# Altium schematic sheet FPGA_MICS_SUP.SchDoc: FMC DAC 1.5GS 4CH
size 420 x 297 mm; Author: G.Kasprowicz; CompanyName: WUT ISE; DrawnBy: G.Kasprowicz; Organization: WUT ISE; Address1: PW ISE; Address2: Nowowiejska 15/19 00-665 Warsaw; Address3: gkasprow@gmail.com; Revision: 1; SheetNumber: 20; SheetTotal: 21; ModifiedBy: -; CheckedDate: -; Title2: FMC; DivGrp: WUT ISE; Designer: G.Kasprowicz; ModifiedDate: -; ProjectName: Sensor Box
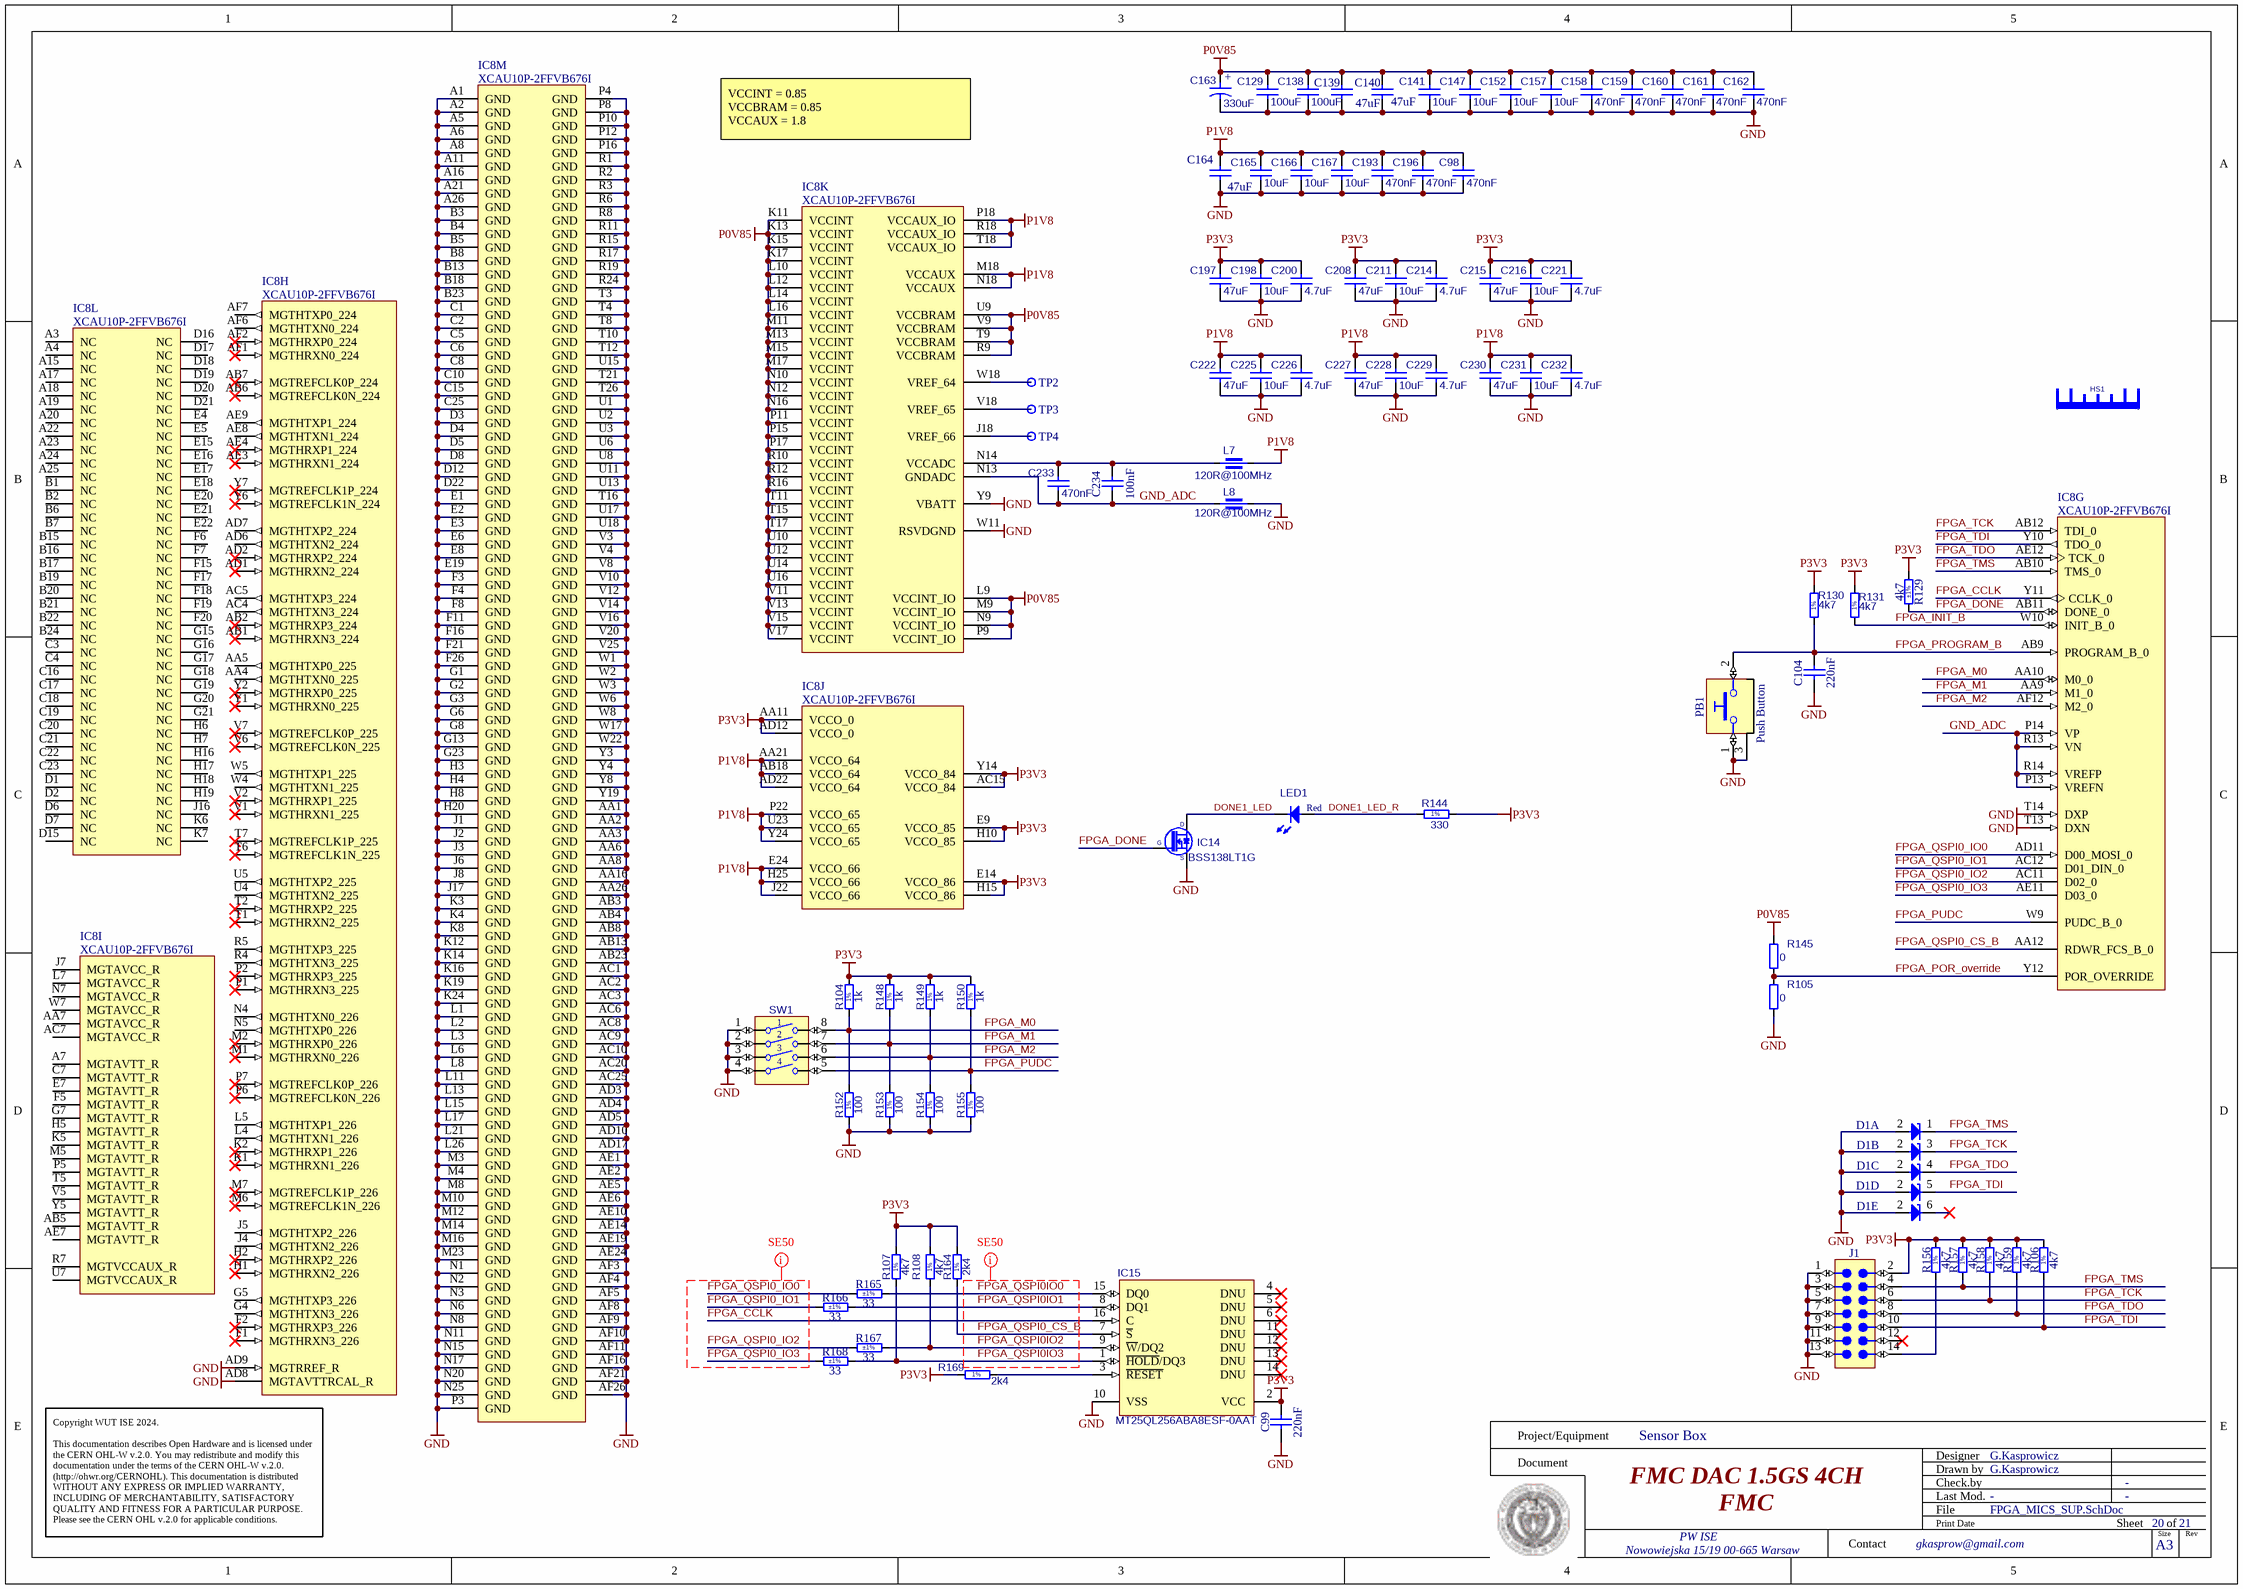
[diagram p0: FPGA_MICS_SUP.SchDoc]

## Parts
C98  470nF  [CAPC0603X33N]
C99  220nF  [CAPC1005X55N]
C104  220nF  [CAPC1005X55N]
C129  100uF  [CAPC2013X145N]
C138  100uF  [CAPC2013X145N]
C139  47uF  [CAPC1608X100N]
C140  47uF  [CAPC1608X100N]
C141  10uF  [CAPC1005X70N]
C147  10uF  [CAPC1005X70N]
C152  10uF  [CAPC1005X70N]
C157  10uF  [CAPC1005X70N]
C158  470nF  [CAPC0603X33N]
C159  470nF  [CAPC0603X33N]
C160  470nF  [CAPC0603X33N]
C161  470nF  [CAPC0603X33N]
C162  470nF  [CAPC0603X33N]
C163  330uF  [CAPMP3528X210N]
C164  47uF  [CAPC1608X100N]
C165  10uF  [CAPC1005X70N]
C166  10uF  [CAPC1005X70N]
C167  10uF  [CAPC1005X70N]
C193  470nF  [CAPC0603X33N]
C196  470nF  [CAPC0603X33N]
C197  47uF  [CAPC1608X100N]
C198  10uF  [CAPC1005X70N]
C200  4.7uF  [CAPC1005X61N]
C208  47uF  [CAPC1608X100N]
C211  10uF  [CAPC1005X70N]
C214  4.7uF  [CAPC1005X61N]
C215  47uF  [CAPC1608X100N]
C216  10uF  [CAPC1005X70N]
C221  4.7uF  [CAPC1005X61N]
C222  47uF  [CAPC1608X100N]
C225  10uF  [CAPC1005X70N]
C226  4.7uF  [CAPC1005X61N]
C227  47uF  [CAPC1608X100N]
C228  10uF  [CAPC1005X70N]
C229  4.7uF  [CAPC1005X61N]
C230  47uF  [CAPC1608X100N]
C231  10uF  [CAPC1005X70N]
C232  4.7uF  [CAPC1005X61N]
C233  470nF  [CAPC0603X33N]
C234  100nF  [CAPC1005X55N]
D1  PESD3V3L5UY  [SOT65P210X110-6N]  (value not drawn)  (parts A,B,C,D,E of 5)
HS1  Heat Sink 2 Pads  [HSINK_WAKEFIELD_960-29-18-D-AB-0]  (value not drawn)
IC8  XCAU10P-2FFVB676I  [BGA676C100P26X26_2700X2700X350]  (parts G,H,I,J,K,L,M of 13)
IC14  BSS138LT1G  [SOT95P240X110-3N]
IC15  MT25QL256ABA8ESF-0AAT  [SOIC127P1030X265-16N]
J1  (no value)  [MOLEX_87832-1420]
L7  120R@100MHz  [INDC1608X95N]
L8  120R@100MHz  [INDC1608X95N]
LED1  Red  [LED_KINGBRIGHT_KPH-1608SURCK]
PB1  Push Button  [PB_OMRON_B3U-1100P]
R104  1k  [RESC1005X40N]
R105  0  [RESC1005X40N]
R106  4k7  [RESC1005X40N]
R107  4k7  [RESC1005X40N]
R108  4k7  [RESC1005X40N]
R129  4k7  Tolerance: ±1%  [RESC1005X40N]
R130  4k7  [RESC1005X40N]
R131  4k7  [RESC1005X40N]
R144  330  [RESC1005X40N]
R145  0  [RESC1005X40N]
R148  1k  [RESC1005X40N]
R149  1k  [RESC1005X40N]
R150  1k  [RESC1005X40N]
R152  100  [RESC1005X40N]
R153  100  [RESC1005X40N]
R154  100  [RESC1005X40N]
R155  100  [RESC1005X40N]
R156  4k7  [RESC1005X40N]
R157  4k7  [RESC1005X40N]
R158  4k7  [RESC1005X40N]
R159  4k7  [RESC1005X40N]
R164  2k4  [RESC1005X40N]
R165  33  Tolerance: ±1%  [RESC1005X40N]
R166  33  Tolerance: ±1%  [RESC1005X40N]
R167  33  Tolerance: ±1%  [RESC1005X40N]
R168  33  Tolerance: ±1%  [RESC1005X40N]
R169  2k4  [RESC1005X40N]
SW1  Switch  [SW_TYCO_1571983-4]  (value not drawn)
TP2  Test Point  [TPS127]  (value not drawn)
TP3  Test Point  [TPS127]  (value not drawn)
TP4  Test Point  [TPS127]  (value not drawn)

## Nets
GND: C98.1 C99.1 C104.1 C129.1 C138.1 C139.1 C140.1 C141.1 C147.1 C152.1 C157.1 C158.1 C159.1 C160.1 C161.1 C162.1 C163.2 C164.1 C165.1 C166.1 C167.1 C193.1 C196.1 C197.1 C198.1 C200.1 C208.1 C211.1 C214.1 C215.1 C216.1 C221.1 C222.1 C225.1 C226.1 C227.1 C228.1 C229.1 C230.1 C231.1 C232.1 D1.2(A) IC8.A1(GND) IC8.A2(GND) IC8.A5(GND) IC8.A6(GND) IC8.A8(GND) IC8.A11(GND) IC8.A16(GND) IC8.A21(GND) IC8.A26(GND) IC8.AA1(GND) IC8.AA2(GND) IC8.AA3(GND) IC8.AA6(GND) IC8.AA8(GND) IC8.AA16(GND) IC8.AA26(GND) IC8.AB3(GND) IC8.AB4(GND) IC8.AB8(GND) IC8.AB13(GND) IC8.AB23(GND) IC8.AC1(GND) IC8.AC2(GND) IC8.AC3(GND) IC8.AC6(GND) IC8.AC8(GND) IC8.AC9(GND) IC8.AC10(GND) IC8.AC20(GND) IC8.AC25(GND) IC8.AD3(GND) IC8.AD4(GND) IC8.AD5(GND) IC8.AD8(MGTAVTTRCAL_R) IC8.AD9(MGTRREF_R) IC8.AD10(GND) IC8.AD17(GND) IC8.AE1(GND) IC8.AE2(GND) IC8.AE5(GND) IC8.AE6(GND) IC8.AE10(GND) IC8.AE14(GND) IC8.AE19(GND) IC8.AE24(GND) IC8.AF3(GND) IC8.AF4(GND) IC8.AF5(GND) IC8.AF8(GND) IC8.AF9(GND) IC8.AF10(GND) IC8.AF11(GND) IC8.AF16(GND) IC8.AF21(GND) IC8.AF26(GND) IC8.B3(GND) IC8.B4(GND) IC8.B5(GND) IC8.B8(GND) IC8.B13(GND) IC8.B18(GND) IC8.B23(GND) IC8.C1(GND) IC8.C2(GND) IC8.C5(GND) IC8.C6(GND) IC8.C8(GND) IC8.C10(GND) IC8.C15(GND) IC8.C25(GND) IC8.D3(GND) IC8.D4(GND) IC8.D5(GND) IC8.D8(GND) IC8.D12(GND) IC8.D22(GND) IC8.E1(GND) IC8.E2(GND) IC8.E3(GND) IC8.E6(GND) IC8.E8(GND) IC8.E19(GND) IC8.F3(GND) IC8.F4(GND) IC8.F8(GND) IC8.F11(GND) IC8.F16(GND) IC8.F21(GND) IC8.F26(GND) IC8.G1(GND) IC8.G2(GND) IC8.G3(GND) IC8.G6(GND) IC8.G8(GND) IC8.G13(GND) IC8.G23(GND) IC8.H3(GND) IC8.H4(GND) IC8.H8(GND) IC8.H20(GND) IC8.J1(GND) IC8.J2(GND) IC8.J3(GND) IC8.J6(GND) IC8.J8(GND) IC8.J17(GND) IC8.K3(GND) IC8.K4(GND) IC8.K8(GND) IC8.K12(GND) IC8.K14(GND) IC8.K16(GND) IC8.K19(GND) IC8.K24(GND) IC8.L1(GND) IC8.L2(GND) IC8.L3(GND) IC8.L6(GND) IC8.L8(GND) IC8.L11(GND) IC8.L13(GND) IC8.L15(GND) IC8.L17(GND) IC8.L21(GND) IC8.L26(GND) IC8.M3(GND) IC8.M4(GND) IC8.M8(GND) IC8.M10(GND) IC8.M12(GND) IC8.M14(GND) IC8.M16(GND) IC8.M23(GND) IC8.N1(GND) IC8.N2(GND) IC8.N3(GND) IC8.N6(GND) IC8.N8(GND) IC8.N11(GND) IC8.N15(GND) IC8.N17(GND) IC8.N20(GND) IC8.N25(GND) IC8.P3(GND) IC8.P4(GND) IC8.P8(GND) IC8.P10(GND) IC8.P12(GND) IC8.P16(GND) IC8.R1(GND) IC8.R2(GND) IC8.R3(GND) IC8.R6(GND) IC8.R8(GND) IC8.R11(GND) IC8.R15(GND) IC8.R17(GND) IC8.R19(GND) IC8.R24(GND) IC8.T3(GND) IC8.T4(GND) IC8.T8(GND) IC8.T10(GND) IC8.T12(GND) IC8.T13(DXN) IC8.T14(DXP) IC8.T16(GND) IC8.T21(GND) IC8.T26(GND) IC8.U1(GND) IC8.U2(GND) IC8.U3(GND) IC8.U6(GND) IC8.U8(GND) IC8.U11(GND) IC8.U13(GND) IC8.U15(GND) IC8.U17(GND) IC8.U18(GND) IC8.V3(GND) IC8.V4(GND) IC8.V8(GND) IC8.V10(GND) IC8.V12(GND) IC8.V14(GND) IC8.V16(GND) IC8.V20(GND) IC8.V25(GND) IC8.W1(GND) IC8.W2(GND) IC8.W3(GND) IC8.W6(GND) IC8.W8(GND) IC8.W11(RSVDGND) IC8.W17(GND) IC8.W22(GND) IC8.Y3(GND) IC8.Y4(GND) IC8.Y8(GND) IC8.Y9(VBATT) IC8.Y19(GND) IC14.2(S) IC15.10(VSS) J1.1 J1.3 J1.5 J1.7 J1.9 J1.11 J1.13 L8.2 PB1.1 PB1.3 R105.1 R152.1 R153.1 R154.1 R155.1 SW1.1 SW1.2 SW1.3 SW1.4
P0V85: C129.2 C138.2 C139.2 C140.2 C141.2 C147.2 C152.2 C157.2 C158.2 C159.2 C160.2 C161.2 C162.2 C163.1 IC8.K11(VCCINT) IC8.K13(VCCINT) IC8.K15(VCCINT) IC8.K17(VCCINT) IC8.L9(VCCINT_IO) IC8.L10(VCCINT) IC8.L12(VCCINT) IC8.L14(VCCINT) IC8.L16(VCCINT) IC8.M9(VCCINT_IO) IC8.M11(VCCINT) IC8.M13(VCCINT) IC8.M15(VCCINT) IC8.M17(VCCINT) IC8.N9(VCCINT_IO) IC8.N10(VCCINT) IC8.N12(VCCINT) IC8.N16(VCCINT) IC8.P9(VCCINT_IO) IC8.P11(VCCINT) IC8.P15(VCCINT) IC8.P17(VCCINT) IC8.R9(VCCBRAM) IC8.R10(VCCINT) IC8.R12(VCCINT) IC8.R16(VCCINT) IC8.T9(VCCBRAM) IC8.T11(VCCINT) IC8.T15(VCCINT) IC8.T17(VCCINT) IC8.U9(VCCBRAM) IC8.U10(VCCINT) IC8.U12(VCCINT) IC8.U14(VCCINT) IC8.U16(VCCINT) IC8.V9(VCCBRAM) IC8.V11(VCCINT) IC8.V13(VCCINT) IC8.V15(VCCINT) IC8.V17(VCCINT) R145.2
P1V8: C98.2 C164.2 C165.2 C166.2 C167.2 C193.2 C196.2 C222.2 C225.2 C226.2 C227.2 C228.2 C229.2 C230.2 C231.2 C232.2 IC8.AA21(VCCO_64) IC8.AB18(VCCO_64) IC8.AD22(VCCO_64) IC8.E24(VCCO_66) IC8.H25(VCCO_66) IC8.J22(VCCO_66) IC8.M18(VCCAUX) IC8.N18(VCCAUX) IC8.P18(VCCAUX_IO) IC8.P22(VCCO_65) IC8.R18(VCCAUX_IO) IC8.T18(VCCAUX_IO) IC8.U23(VCCO_65) IC8.Y24(VCCO_65) L7.2
P3V3: C99.2 C197.2 C198.2 C200.2 C208.2 C211.2 C214.2 C215.2 C216.2 C221.2 IC8.AA11(VCCO_0) IC8.AC15(VCCO_84) IC8.AD12(VCCO_0) IC8.E9(VCCO_85) IC8.E14(VCCO_86) IC8.H10(VCCO_85) IC8.H15(VCCO_86) IC8.Y14(VCCO_84) IC15.2(VCC) J1.2 R104.2 R106.2 R107.2 R108.2 R129.2 R130.2 R131.2 R144.2 R148.2 R149.2 R150.2 R156.2 R157.2 R158.2 R159.2 R164.2 R169.1
DONE1_LED: IC14.3(D) LED1.1(C)
DONE1_LED_R: LED1.2(A) R144.1
FPGA_CCLK: IC8.Y11(CCLK_0) IC15.16(C)
FPGA_DONE: IC8.AB11(DONE_0) IC14.1(G) R129.1
FPGA_INIT_B: IC8.W10(INIT_B_0) R131.1
FPGA_M0: IC8.AA10(M0_0) R104.1 R152.2 SW1.8
FPGA_M1: IC8.AA9(M1_0) R148.1 R153.2 SW1.7
FPGA_M2: IC8.AF12(M2_0) R149.1 R154.2 SW1.6
FPGA_POR_override: IC8.Y12(POR_OVERRIDE) R105.2 R145.1
FPGA_PROGRAM_B: C104.2 IC8.AB9(PROGRAM_B_0) PB1.2 R130.1
FPGA_PUDC: IC8.W9(PUDC_B_0) R150.1 R155.2 SW1.5
FPGA_QSPI0_CS_B: IC8.AA12(RDWR_FCS_B_0) IC15.7(~{S}) R164.1
FPGA_QSPI0_IO0: IC8.AD11(D00_MOSI_0) R165.1
FPGA_QSPI0_IO1: IC8.AC12(D01_DIN_0) R166.1
FPGA_QSPI0_IO2: IC8.AC11(D02_0) R167.1
FPGA_QSPI0_IO3: IC8.AE11(D03_0) R168.1
FPGA_QSPI0IO0: IC15.15(DQ0) R165.2
FPGA_QSPI0IO1: IC15.8(DQ1) R166.2
FPGA_QSPI0IO2: IC15.9(~{W}/DQ2) R108.1 R167.2
FPGA_QSPI0IO3: IC15.1(~{HOLD}/DQ3) R107.1 R168.2
FPGA_TCK: D1.3(C) IC8.AB12(TDI_0) J1.6 R158.1
FPGA_TDI: D1.5(C) IC8.Y10(TDO_0) J1.10 R106.1
FPGA_TDO: D1.4(C) IC8.AE12(TCK_0) J1.8 R159.1
FPGA_TMS: D1.1(C) IC8.AB10(TMS_0) J1.4 R157.1
GND_ADC: C233.1 C234.1 IC8.N13(GNDADC) IC8.P13(VREFN) IC8.P14(VP) IC8.R13(VN) IC8.R14(VREFP) L8.1
NetC233_2: C233.2 C234.2 IC8.N14(VCCADC) L7.1
NetIC8_J18: IC8.J18(VREF_66) TP4.1
NetIC8_V18: IC8.V18(VREF_65) TP3.1
NetIC8_W18: IC8.W18(VREF_64) TP2.1
NetIC15_3: IC15.3(~{RESET}) R169.2
NetJ1_14: J1.14 R156.1

Not connected (* = marked no-connect by the designer): D1 6(C)*; HS1 1 2; IC8 A3(NC) A4(NC) A7(MGTAVTT_R) A15(NC) A17(NC) A18(NC) A19(NC) A20(NC) A22(NC) A23(NC) A24(NC) A25(NC) AA4(MGTHTXN0_225) AA5(MGTHTXP0_225) AA7(MGTAVCC_R) AB1(MGTHRXN3_224)* AB2(MGTHRXP3_224)* AB5(MGTAVTT_R) AB6(MGTREFCLK0N_224)* AB7(MGTREFCLK0P_224)* AC4(MGTHTXN3_224) AC5(MGTHTXP3_224) AC7(MGTAVCC_R) AD1(MGTHRXN2_224)* AD2(MGTHRXP2_224)* AD6(MGTHTXN2_224) AD7(MGTHTXP2_224) AE3(MGTHRXN1_224)* AE4(MGTHRXP1_224)* AE7(MGTAVTT_R) AE8(MGTHTXN1_224) AE9(MGTHTXP1_224) AF1(MGTHRXN0_224)* AF2(MGTHRXP0_224)* AF6(MGTHTXN0_224) AF7(MGTHTXP0_224) B1(NC) B2(NC) B6(NC) B7(NC) B15(NC) B16(NC) B17(NC) B19(NC) B20(NC) B21(NC) B22(NC) B24(NC) C3(NC) C4(NC) C7(MGTAVTT_R) C16(NC) C17(NC) C18(NC) C19(NC) C20(NC) C21(NC) C22(NC) C23(NC) D1(NC) D2(NC) D6(NC) D7(NC) D15(NC) D16(NC) D17(NC) D18(NC) D19(NC) D20(NC) D21(NC) E4(NC) E5(NC) E7(MGTAVTT_R) E15(NC) E16(NC) E17(NC) E18(NC) E20(NC) E21(NC) E22(NC) F1(MGTHRXN3_226)* F2(MGTHRXP3_226)* F5(MGTAVTT_R) F6(NC) F7(NC) F15(NC) F17(NC) F18(NC) F19(NC) F20(NC) G4(MGTHTXN3_226) G5(MGTHTXP3_226) G7(MGTAVTT_R) G15(NC) G16(NC) G17(NC) G18(NC) G19(NC) G20(NC) G21(NC) H1(MGTHRXN2_226)* H2(MGTHRXP2_226)* H5(MGTAVTT_R) H6(NC) H7(NC) H16(NC) H17(NC) H18(NC) H19(NC) J4(MGTHTXN2_226) J5(MGTHTXP2_226) J7(MGTAVCC_R) J16(NC) K1(MGTHRXN1_226)* K2(MGTHRXP1_226)* K5(MGTAVTT_R) K6(NC) K7(NC) L4(MGTHTXN1_226) L5(MGTHTXP1_226) L7(MGTAVCC_R) M1(MGTHRXN0_226)* M2(MGTHRXP0_226)* M5(MGTAVTT_R) M6(MGTREFCLK1N_226)* M7(MGTREFCLK1P_226)* N4(MGTHTXN0_226) N5(MGTHTXP0_226) N7(MGTAVCC_R) P1(MGTHRXN3_225)* P2(MGTHRXP3_225)* P5(MGTAVTT_R) P6(MGTREFCLK0N_226)* P7(MGTREFCLK0P_226)* R4(MGTHTXN3_225) R5(MGTHTXP3_225) R7(MGTVCCAUX_R) T1(MGTHRXN2_225)* T2(MGTHRXP2_225)* T5(MGTAVTT_R) T6(MGTREFCLK1N_225)* T7(MGTREFCLK1P_225)* U4(MGTHTXN2_225) U5(MGTHTXP2_225) U7(MGTVCCAUX_R) V1(MGTHRXN1_225)* V2(MGTHRXP1_225)* V5(MGTAVTT_R) V6(MGTREFCLK0N_225)* V7(MGTREFCLK0P_225)* W4(MGTHTXN1_225) W5(MGTHTXP1_225) W7(MGTAVCC_R) Y1(MGTHRXN0_225)* Y2(MGTHRXP0_225)* Y5(MGTAVTT_R) Y6(MGTREFCLK1N_224)* Y7(MGTREFCLK1P_224)*; IC15 4(DNU)* 5(DNU)* 6(DNU)* 11(DNU)* 12(DNU)* 13(DNU)* 14(DNU)*; J1 12*

## Layout directives
net class SE50: FPGA_CCLK, FPGA_QSPI0_CS_B, FPGA_QSPI0_IO0, FPGA_QSPI0_IO1, FPGA_QSPI0_IO2, FPGA_QSPI0_IO3, FPGA_QSPI0IO0, FPGA_QSPI0IO1, FPGA_QSPI0IO2, FPGA_QSPI0IO3

## Notes on the sheet
- VCCINT = 0.85
  VCCBRAM = 0.85
  VCCAUX = 1.8
- Project/Equipment
- Document
- Designer
- Drawn by
- Check.by
- Copyright WUT ISE 2024.
  This documentation describes Open Hardware and is licensed under the CERN OHL-W v.2.0. You may redistribute and modify this documentation under the terms of the CERN OHL-W v.2.0. (http://ohwr.org/CERNOHL). This documentation is distributed WITHOUT ANY EXPRESS OR IMPLIED WARRANTY, INCLUDING OF MERCHANTABILITY, SATISFACTORY QUALITY AND FITNESS FOR A PARTICULAR PURPOSE. Please see the CERN OHL v.2.0 for applicable conditions.
- Contact
- File
- Last Mod.
- Print Date
- Sheet
- Size
- A3
- of
- Rev
- (in symbol CTE3528-21_330UF_2.5V_20%_LESR0015_KEMET_T520) +
- (in symbol R0402_1k_1%_0.0625W_100PPM) 1%
- (in symbol R0402_2K4_1%_0.0625W_100PPM) 1%
- (in symbol R0402_4K7_1%_0.0625W_100PPM) 1%
- (in symbol R0402_4k7_1%_0.0625W_100PPM) 1%
- (in symbol R0402_100R_1%_0.0625W_100PPM) 1%
- (in symbol R0402_330R_1%_0.0625W_100PPM) 1%

## Library data of the parts
C98 C158-C162 C193 C196 C233 = CC0201_470NF_4V_20%_X5R: Non-polarised capacitor; Part Description: SMD Multilayer Chip Ceramic Capacitor; Manufacturer: GENERIC; Manufacturer1 Part Number: AMK063BJ474MP-F; Voltage: 4V; TC: X5R; Tolerance: ±20%; Part Number: CC0201_470NF_4V_20%_X5R; Component Kind: Standard; Component Type: Standard; Pin Count: 2; Value: 470nF; Status: Not Recommended; Manufacturer Part Number: CC0201_470NF_4V_20%_X5R; Case: 0201; Mounted: Yes; Socket: No; SMD: Yes; Sense: No; Manufacturer1 Example: TAIYO YUDEN; Manufacturer1 ComponentHeight: 0.33mm; HelpURL: \\cern.ch\dfs\Applications\Altium\Datasheets\CC0201_X5R_TAIYO-YUDEN_STANDARD-CLASS2.pdf; Author: CERN DEM JLC; CreateDate: 27.05.2010; LatestRevisionDate: 27.05.2010
C99 C104 = CC0402_220NF_16V_10%_X7R: Non-polarised capacitor; Part Description: SMD Multilayer Chip Ceramic Capacitor; Manufacturer: GENERIC; Manufacturer1 Part Number: C1005X7R1C224K050; Voltage: 16V; TC: X7R; Tolerance: ±10%; Part Number: CC0402_220NF_16V_10%_X7R; Component Kind: Standard; Component Type: Standard; Pin Count: 2; Value: 220nF; Status: Preferred; Manufacturer Part Number: CC0402_220NF_16V_10%_X7R; Case: 0402; Mounted: Yes; Socket: No; SMD: Yes; Sense: No; Manufacturer1 Example: TDK; Manufacturer1 ComponentHeight: 0.55mm; HelpURL: \\cern.ch\dfs\Applications\Altium\Datasheets\CC0402_X7R_TDK_C.pdf; Author: CERN DEM JLC; CreateDate: 25.10.2012; LatestRevisionDate: 25.10.2012
C129 C138 = CC0805_100UF_4V_20%_X6S_MURATA_GRM21BC80G107ME15: Non-polarised capacitor; Part Description: Chip Multilayer Ceramic Capacitor for General Purpose; Manufacturer: MURATA; Voltage: 4V; TC: X6S; Tolerance: ±20%; Part Number: CC0805_100UF_4V_20%_X6S_MURATA_GRM21BC80G107ME15; Component Kind: Standard; Component Type: Standard; Pin Count: 2; Value: 100uF; Status: None; Manufacturer Part Number: GRM21BC80G107ME15; Case: 0805; Mounted: Yes; Socket: No; SMD: Yes; Sense: No; ComponentHeight: 1.45mm; HelpURL: \\cern.ch\dfs\Applications\Altium\Datasheets\CC0805_MURATA_GRM21BC80G107ME15.pdf; Author: CERN DEM BC; CreateDate: 2020-09-02; LatestRevisionDate: 2020-09-02
C139 C140 C164 = CC0603_47UF_6.3V_20%_X5R: Non-polarised capacitor; Manufacturer: GENERIC; Part Description: SMD Multilayer Chip Ceramic Capacitor; Manufacturer1 Part Number: GRM188R60J476ME15D; Tolerance: ±20%; Voltage: 6.3V; TC: X5R; Manufacturer Part Number: CC0603_47UF_6.3V_20%_X5R; Part Number: CC0603_47UF_6.3V_20%_X5R; Value: 47uF; Component Kind: Standard; Component Type: Standard; Pin Count: 2; Status: None; Case: 0603; Mounted: Yes; Socket: No; SMD: Yes; Sense: No; Manufacturer1 Example: MURATA; Manufacturer1 ComponentHeight: 1mm; HelpURL: \\cern.ch\dfs\Applications\Altium\Datasheets\CC0603_MURATA_GRM188R60J476ME15D.pdf; Author: CERN DEM JLC; CreateDate: 01.02.2018; LatestRevisionDate: 01.02.2018
C141 C147 C152 C157 C165-C167 C198 C211 C216 C225 C228 C231 = CC0402_10UF_6.3V_20%_X5R: Non-polarised capacitor; Part Description: SMD Multilayer Chip Ceramic Capacitor; Manufacturer: GENERIC; Manufacturer1 Part Number: C1005X5R0J106M050BC; Voltage: 6.3V; TC: X5R; Tolerance: ±10%; Part Number: CC0402_10UF_6.3V_20%_X5R; Component Kind: Standard; Component Type: Standard; Pin Count: 2; Value: 10uF; Status: Preferred; Manufacturer Part Number: CC0402_10UF_6.3V_20%_X5R; Case: 0402; Mounted: Yes; Socket: No; SMD: Yes; Sense: No; Manufacturer1 Example: TDK; Manufacturer1 ComponentHeight: 0.70mm; HelpURL: \\cern.ch\dfs\Applications\Altium\Datasheets\CC0402_X5R_TDK_C.pdf; Author: CERN DEM JLC; CreateDate: 07.01.2015; LatestRevisionDate: 07.01.2015
C163 = CTE3528-21_330UF_2.5V_20%_LESR0015_KEMET_T520: Polarised capacitor; Part Description: Low ESR 0R015 Tantalum Chip Capacitor; Manufacturer: KEMET; Manufacturer Part Number: T520B337M2R5ATE015; Voltage: 2.5V; Tolerance: ±20%; Part Number: CTE3528-21_330UF_2.5V_20%_LESR0015_KEMET_T520; Component Kind: Standard; Component Type: Standard; Pin Count: 2; Value: 330uF; Status: None; Case: B; Mounted: Yes; Socket: No; SMD: Yes; Sense: No; ComponentHeight: 2.1mm; HelpURL: \\cern.ch\dfs\Applications\Altium\Datasheets\CTE-LESR_KEMET_T520.pdf; Author: CERN DEM JLC; CreateDate: 07.03.2012; LatestRevisionDate: 01.09.2014
C197 C208 C215 C222 C227 C230 = CC0603_47UF_6.3V_20%_X5R: Non-polarised capacitor; Part Description: SMD Multilayer Chip Ceramic Capacitor; Manufacturer: GENERIC; Manufacturer1 Part Number: GRM188R60J476ME15D; Voltage: 6.3V; TC: X5R; Tolerance: ±20%; Part Number: CC0603_47UF_6.3V_20%_X5R; Component Kind: Standard; Component Type: Standard; Pin Count: 2; Value: 47uF; Status: None; Manufacturer Part Number: CC0603_47UF_6.3V_20%_X5R; Case: 0603; Mounted: Yes; Socket: No; SMD: Yes; Sense: No; Manufacturer1 Example: MURATA; Manufacturer1 ComponentHeight: 1mm; HelpURL: \\cern.ch\dfs\Applications\Altium\Datasheets\CC0603_MURATA_GRM188R60J476ME15D.pdf; Author: CERN DEM JLC; CreateDate: 2018-02-01; LatestRevisionDate: 2018-02-01
C200 C214 C221 C226 C229 C232 = CC0402_4.7UF_4V_20%_X6S_TDK_C1005X6S0G475M050BC: Non-polarised capacitor; Part Description: SMD Multilayer Chip Ceramic Capacitor (Commercial Grade); Manufacturer: TDK; Voltage: 4V; TC: X6S; Tolerance: ±20%; Part Number: CC0402_4.7UF_4V_20%_X6S_TDK_C1005X6S0G475M050BC; Component Kind: Standard; Component Type: Standard; Pin Count: 2; Value: 4.7uF; Status: None; Manufacturer Part Number: C1005X6S0G475M050BC; Case: 0402; Mounted: Yes; Socket: No; SMD: Yes; Sense: No; ComponentHeight: 0.65mm; HelpURL: \\cern.ch\dfs\Applications\Altium\Datasheets\CC0402_X6S_TDK_C(up to 75V).pdf; Author: CERN DEM BC; CreateDate: 2020-09-14; LatestRevisionDate: 2020-09-14
C234 = CC0402_100NF_16V_10%_X5R: Non-polarised capacitor; Part Description: SMD Multilayer Chip Ceramic Capacitor; Manufacturer: GENERIC; Manufacturer1 Part Number: GRM155R61C104KA88D; Voltage: 16V; TC: X5R; Tolerance: ±10%; Part Number: CC0402_100NF_16V_10%_X5R; Component Kind: Standard; Component Type: Standard; Pin Count: 2; Value: 100nF; Status: None; Manufacturer Part Number: CC0402_100NF_16V_10%_X5R; Case: 0402; Mounted: Yes; Socket: No; SMD: Yes; Sense: No; Manufacturer1 Example: MURATA; Manufacturer1 ComponentHeight: 0.55mm; HelpURL: \\cern.ch\dfs\Applications\Altium\Datasheets\CC0402_X5R_MURATA_GRM.pdf; Author: CERN DEM JLC; CreateDate: 10.12.2013; LatestRevisionDate: 10.12.2013
D1 = PESD3V3L5UY: Fivefold ESD Protection Diode Arrays; Part Description: Fivefold ESD Protection Diode Arrays (30kV); Manufacturer: NEXPERIA; Voltage: 3.3V; Power: 200W; PressFit: No; Bonding: No; Part Number: PESD3V3L5UY; Component Kind: Standard; Component Type: Standard; Device: PESD3V3L5UY; PackageDescription: SOT363, SC-88, 0.65mm Pitch; 6 Pin, 1.25mm W X 2.00mm L X 1.10mm H body, IPC Medium Density; Manufacturer Part Number: PESD3V3L5UY; Pin Count: 6; Case: SOT363; Mounted: Yes; Socket: No; SMD: Yes; Sense: No; ComponentHeight: 1.1mm; HelpURL: \\cern.ch\dfs\Applications\Altium\Datasheets\PESD3V3L5UY.pdf; Author: CERN DEM WB; CreateDate: 05/07/2021; LatestRevisionDate: 05/07/2021
HS1 = HSINK_WAKEFIELD_960-29-12-D-AB-0: Heat Sink With 2 pads; Part Description: Extruded Heat Sink for PCB Mounting with Plastic Push Pin, Height 12mm; Manufacturer: WAKEFIELD-VETTE; PressFit: No; Part Number: HSINK_WAKEFIELD_960-29-12-D-AB-0; Component Kind: Standard; Component Type: Mechanical; Footprint: HSINK_WAKEFIELD_960-29-12-D-AB-0; Pin Count: 2; PackageDescription: Extruded Heat Sink for PCB Mounting with Plastic Push Pin - L 30mm x W 29.5mm x H 12mm; Mounted: Yes; Socket: No; SMD: No; Sense: No; Status: None; Manufacturer Part Number: 960-29-12-D-AB-0; ComponentHeight: 12mm; HelpURL: \\cern.ch\dfs\Applications\Altium\Datasheets\HSINK_WAKEFIELD_960-29-12-D-AB-0.pdf; Author: CERN DEM BC; CreateDate: 24.07.2020; LatestRevisionDate: 24.07.2020
IC8 = XCAU10P-2FFVB676I: Artix UltraScale + Field Programmable Gate Array (FPGA), 676-Pin BGA, Industrial Grade; Manufacturer: AMD; PressFit: No; Bonding: No; Part Number: XCAU10P-2FFVB676I; Component Kind: Standard; Component Type: Standard; Device: XCAU10P-2FFVB676I; PackageDescription: BGA, 1.00mm Pitch, Square; 672 Pin, 26 Columns X 26 Rows, Body 27.00mm X 27.00mm X 3.50mm H, IPC Medium Density; Part Description: Artix UltraScale + Field Programmable Gate Array (FPGA), 676-Pin BGA, Industrial Grade; Manufacturer Part Number: XCAU10P-2FFVB676I; Pin Count: 676; Case: BGA676; Mounted: Yes; Socket: No; SMD: Yes; Sense: No; ComponentHeight: 3.50mm; HelpURL: \\cern.ch\dfs\Applications\Altium\Datasheets\XCAU10P-2FFVB676I.pdf; ComponentLink1URL: \\cern.ch\dfs\Applications\Altium\Datasheets\XCAU10P-2FFVB676I_Package.pdf; ComponentLink1Description: Package Drawing; ComponentLink2URL: \\cern.ch\dfs\Applications\Altium\Datasheets\XCAU10P-2FFVB676I_Pinout.pdf; ComponentLink2Description: Pinout; Author: CERN DEM HF; CreateDate: 10.02.2025; LatestRevisionDate: 10.02.2025
IC14 = BSS138LT1G: N-CHANNEL MOSFET WITH DIODE; Part Description: 50V 200mA N-Channel Enhancement Mode Field-Effect Transistor; Manufacturer: ON SEMICONDUCTOR; PressFit: No; Bonding: No; Part Number: BSS138LT1G; Component Kind: Standard; Component Type: Standard; Device: BSS138LT1G; PackageDescription: SOT23 3-Leads, Pitch 0.95mm - Body 1.4x3mm, IPC Medium Density; Manufacturer Part Number: BSS138LT1G; Pin Count: 3; Case: SOT23-3; Mounted: Yes; Socket: No; SMD: Yes; Sense: No; ComponentHeight: 1.11mm; HelpURL: \\cern.ch\dfs\Applications\Altium\Datasheets\BSS138LT1G.pdf; Author: CERN DEM JLC; CreateDate: 23.03.2009; LatestRevisionDate: 23.03.2009
IC15 = MT25QL256ABA8ESF-0AAT: 256Mbit (32MB), 2.7V-3.6V, Multiple I/O Serial NOR Flash Memory,with Reset# & Hold#; Part Description: 256Mbit (32MB), 2.7V-3.6V, Multiple I/O Serial NOR Flash Memory,with Reset# & Hold# (Automotive grade AEC-Q100); Manufacturer: MICRON TECHNOLOGY; PressFit: No; Bonding: No; Part Number: MT25QL256ABA8ESF-0AAT; Component Kind: Standard; Component Type: Standard; Device: MT25QL256ABA8ESF-0AAT; PackageDescription: SOIC, 1.27mm Pitch; 16 Pin, 7.50mm W X 10.3mm L X 2.65mm H body, IPC Medium Density; Manufacturer Part Number: MT25QL256ABA8ESF-0AAT; Pin Count: 16; Case: SOIC16; Mounted: Yes; Socket: No; SMD: Yes; Sense: No; ComponentHeight: 2.65mm; HelpURL: \\cern.ch\dfs\Applications\Altium\Datasheets\MT25QL256ABA8ESF-0AAT.pdf; Author: CERN DEM JLC; CreateDate: 2018-11-05; LatestRevisionDate: 2018-11-05
J1 = MOLEX_87832-1420: Connector 14 Male; Part Description: 2.00mm (.079") Pitch Milli-Grid™ Header, Surface Mount, Vertical, Shrouded, 14 Circuits, with Locking Windows and Centre Polarization Slot, PCB Locator; Manufacturer: MOLEX; PressFit: No; Part Number: MOLEX_87832-1420; Component Kind: Standard; Component Type: Standard; Pin Count: 14; Family: Milli-Grid™; Mounted: Yes; Socket: No; SMD: Yes; Manufacturer Part Number: 87832-1420; ComponentHeight: 7.6mm; HelpURL: \\cern.ch\dfs\Applications\Altium\Datasheets\MOLEX_87832-1420.pdf; Author: CERN DEM JLC; CreateDate: 09/09/2008; LatestRevisionDate: 09/09/2008; Table: MOLEX; Status: None; Supplier: Radiospares; SupplierRef: 6701071; Sense: No
L7 L8 = IND0603_MURATA_BLM18PG121SN1D: Part Description: SMD EMIFIL Chip Ferrite Bead; Manufacturer: MURATA; Power: 2A; Resistance: 0.05R; Part Number: IND0603_MURATA_BLM18PG121SN1D; Component Kind: Standard; Component Type: Standard; Pin Count: 2; Value: 120R@100MHz; Status: None; Manufacturer Part Number: BLM18PG121SN1D; Case: 0603; Mounted: Yes; Socket: No; SMD: Yes; Sense: No; ComponentHeight: 0.95mm; HelpURL: \\cern.ch\dfs\Applications\Altium\Datasheets\IND0603_MURATA_BLM18P.pdf; Author: CERN DEM BC; CreateDate: 27.07.2015; LatestRevisionDate: 25.10.2018
LED1 = LED_KINGBRIGHT_KPH-1608SURCK: LED Red 1C 2A; Part Description: SMD Hyper Red LED, Case 1.6mmX0.8mm(0603), 0.65mm Thickness; PressFit: No; Bonding: No; Part Number: LED_KINGBRIGHT_KPH-1608SURCK; Component Kind: Standard; Component Type: Standard; Color: Red; PackageDescription: SMT Hyper Red LED, Case 0603, Body L 1.6 x W 0.8mm H 0.65mm; Manufacturer: KINGBRIGHT; Manufacturer Part Number: KPH-1608SURCK; Pin Count: 2; Mounted: Yes; Socket: No; SMD: Yes; Sense: No; ComponentHeight: 0.65mm; HelpURL: \\cern.ch\dfs\Applications\Altium\Datasheets\LED_KINGBRIGHT_KPH-1608SURCK.pdf; Author: CERN DEM JLC; CreateDate: 03.07.2017; LatestRevisionDate: 03.07.2017
PB1 = PB_OMRON_B3U-1100P: Push-Button Switch SPDT; Part Description: 3x2.5mm Ultra-Small Tactile SPST Pushbutton Switch (with Ground Terminal),Contact Rating 50mA 12VDC, B3U Series; Manufacturer: OMRON; PressFit: No; Part Number: PB_OMRON_B3U-1100P; Component Kind: Standard; Component Type: Standard; Pin Count: 3; PackageDescription: Body 1.2x3x2.5mm Ultra-Small Tactile SPST Pushbutton Switch, (with Ground Terminal), OMRON B3U Series; Family: Push Button; Mounted: Yes; Socket: No; SMD: Yes; Sense: No; Status: None; Manufacturer Part Number: PB_OMRON_B3U-1100P; ComponentHeight: 1.75mm; HelpURL: \\cern.ch\dfs\Applications\Altium\Datasheets\PB_OMRON_B3U-1100P.pdf; Author: CERN DEM JLC; CreateDate: 16-Mar-10; LatestRevisionDate: 16-Mar-10
R104 R148-R150 = R0402_1k_1%_0.0625W_100PPM: Resistor - 1%; Part Description: General Purpose Thick Film Chip Resistor; Manufacturer: GENERIC; Manufacturer1 Part Number: 232270671002L; TC: ±100ppm/°C; PressFit: No; Part Number: R0402_1K_1%_0.0625W_100PPM; Component Kind: Standard; Component Type: Standard; Pin Count: 2; Value: 1k; Status: Not Recommended; Power: 0.0625W; Tolerance: ±1%; Manufacturer Part Number: R0402_1K_1%_0.0625W_100PPM; Case: 0402; Mounted: Yes; Sense: No; Socket: No; SMD: Yes; Manufacturer1 Example: YAGEO PHYCOMP; Manufacturer1 ComponentHeight: 0.4mm; HelpURL: \\cern.ch\dfs\Applications\Altium\Datasheets\R0402_Phycomp_RC0402.pdf; Author: CERN DEM JLC; CreateDate: 2007-12-03; LatestRevisionDate: 2012-10-17
R105 R145 = R0402_0R_JUMPER: Resistor; Manufacturer: GENERIC; Part Description: 1A (0.05R Max DC Resistance) Zero Ohm Jumper; Manufacturer1 Part Number: 232270591001L; PressFit: No; Manufacturer Part Number: R0402_0R_JUMPER; Part Number: R0402_0R_JUMPER; Value: 0; Component Kind: Standard; Component Type: Standard; Pin Count: 2; Status: Not Recommended; Case: 0402; Mounted: Yes; Sense: No; Socket: No; SMD: Yes; Manufacturer1 Example: YAGEO PHYCOMP; Manufacturer1 ComponentHeight: 0.4mm; HelpURL: \\cern.ch\dfs\Applications\Altium\Datasheets\R0402_Phycomp_RC0402.pdf; Author: CERN DEM JLC; CreateDate: 2007-12-03; LatestRevisionDate: 2012-10-17
R106 R129 R156-R159 = R0402_4K7_1%_0.0625W_100PPM: Resistor - 1%; Part Description: General Purpose Thick Film Chip Resistor; Manufacturer: GENERIC; Manufacturer1 Part Number: 232270674702L; TC: ±100ppm/°C; PressFit: No; Part Number: R0402_4K7_1%_0.0625W_100PPM; Component Kind: Standard; Component Type: Standard; Pin Count: 2; Value: 4k7; Status: Not Recommended; Power: 0.0625W; Manufacturer Part Number: R0402_4K7_1%_0.0625W_100PPM; Case: 0402; Mounted: Yes; Sense: No; Socket: No; SMD: Yes; Manufacturer1 Example: YAGEO PHYCOMP; Manufacturer1 ComponentHeight: 0.4mm; HelpURL: \\cern.ch\dfs\Applications\Altium\Datasheets\R0402_Phycomp_RC0402.pdf; Author: CERN DEM JLC
  R106 R156-R159: Tolerance: ±1%; CreateDate: 03/12/2007; LatestRevisionDate: 17/10/2012
  R129: CreateDate: 03.12.2007; LatestRevisionDate: 17.10.2012
R107 R108 = R0402_4K7_1%_0.0625W_100PPM: Resistor - 1%; Manufacturer: GENERIC; Part Description: General Purpose Thick Film Chip Resistor; Manufacturer1 Part Number: 232270674702L; TC: ±100ppm/°C; PressFit: No; Manufacturer Part Number: R0402_4K7_1%_0.0625W_100PPM; Part Number: R0402_4K7_1%_0.0625W_100PPM; Tolerance: ±1%; Value: 4k7; Component Kind: Standard; Component Type: Standard; Pin Count: 2; Status: Not Recommended; Power: 0.0625W; Case: 0402; Mounted: Yes; Sense: No; Socket: No; SMD: Yes; Manufacturer1 Example: YAGEO PHYCOMP; Manufacturer1 ComponentHeight: 0.4mm; HelpURL: \\cern.ch\dfs\Applications\Altium\Datasheets\R0402_Phycomp_RC0402.pdf; Author: CERN DEM JLC; CreateDate: 03.12.2007; LatestRevisionDate: 17.10.2012
R130 R131 = R0402_4k7_1%_0.0625W_100PPM: Resistor - 1%; Manufacturer: GENERIC; Part Description: General Purpose Thick Film Chip Resistor; Manufacturer1 Part Number: 232270674702L; TC: ±100ppm/°C; PressFit: No; Manufacturer Part Number: R0402_4K7_1%_0.0625W_100PPM; Part Number: R0402_4K7_1%_0.0625W_100PPM; Tolerance: ±1%; Value: 4k7; Component Kind: Standard; Component Type: Standard; Pin Count: 2; Status: Not Recommended; Power: 0.0625W; Case: 0402; Mounted: Yes; Sense: No; Socket: No; SMD: Yes; Manufacturer1 Example: YAGEO PHYCOMP; Manufacturer1 ComponentHeight: 0.4mm; HelpURL: \\cern.ch\dfs\Applications\Altium\Datasheets\R0402_Phycomp_RC0402.pdf; Author: CERN DEM JLC; CreateDate: 2007-12-03; LatestRevisionDate: 2012-10-17
R144 = R0402_330R_1%_0.0625W_100PPM: Resistor - 1%; Part Description: General Purpose Thick Film Chip Resistor; Manufacturer: GENERIC; Manufacturer1 Part Number: 232270673301L; TC: ±100ppm/°C; Table: Resistors SMD; Part Number: R0402_330R_1%_0.0625W_100PPM; Component Kind: Standard; Component Type: Standard; Pin Count: 2; Value: 330; Status: Not recommended; Power: 0.0625W; Tolerance: ±1%; Manufacturer Part Number: R0402_330R_1%_0.0625W_100PPM; Case: 0402; Mounted: Yes; Socket: No; SMD: Yes; Manufacturer1 Example: YAGEO PHYCOMP; Manufacturer1 ComponentHeight: 0.4mm; HelpURL: \\cern.ch\dfs\Applications\Altium\Datasheets\R0402_Phycomp_RC0402.pdf; Author: CERN DEM JLC; CreateDate: 2007-12-03; LatestRevisionDate: 2012-10-17
R152-R155 = R0402_100R_1%_0.0625W_100PPM: Resistor - 1%; Part Description: General Purpose Thick Film Chip Resistor; Manufacturer: GENERIC; Manufacturer1 Part Number: 232270671001L; TC: ±100ppm/°C; PressFit: No; Part Number: R0402_100R_1%_0.0625W_100PPM; Component Kind: Standard; Component Type: Standard; Pin Count: 2; Value: 100; Status: Not Recommended; Power: 0.0625W; Tolerance: ±1%; Manufacturer Part Number: R0402_100R_1%_0.0625W_100PPM; Case: 0402; Mounted: Yes; Sense: No; Socket: No; SMD: Yes; Manufacturer1 Example: YAGEO PHYCOMP; Manufacturer1 ComponentHeight: 0.4mm; HelpURL: \\cern.ch\dfs\Applications\Altium\Datasheets\R0402_Phycomp_RC0402.pdf; Author: CERN DEM JLC; CreateDate: 03-Dec-07; LatestRevisionDate: 17-Oct-12
R164 R169 = R0402_2K4_1%_0.0625W_100PPM: Resistor - 1%; Manufacturer: GENERIC; Part Description: General Purpose Thick Film Chip Resistor; Manufacturer1 Part Number: 232270672402L; TC: ±100ppm/°C; PressFit: No; Manufacturer Part Number: R0402_2K4_1%_0.0625W_100PPM; Part Number: R0402_2K4_1%_0.0625W_100PPM; Tolerance: ±1%; Value: 2k4; Component Kind: Standard; Component Type: Standard; Pin Count: 2; Status: Not Recommended; Power: 0.0625W; Case: 0402; Mounted: Yes; Sense: No; Socket: No; SMD: Yes; Manufacturer1 Example: YAGEO PHYCOMP; Manufacturer1 ComponentHeight: 0.4mm; HelpURL: \\cern.ch\dfs\Applications\Altium\Datasheets\R0402_Phycomp_RC0402.pdf; Author: CERN DEM JLC; CreateDate: 03.12.2007; LatestRevisionDate: 17.10.2012
R165-R168 = R0402_33R_1%_0.0625W_100PPM: Resistor - 1%; Part Description: General Purpose Thick Film Chip Resistor; Manufacturer: GENERIC; Manufacturer1 Part Number: 232270673309L; TC: ±100ppm/°C; PressFit: No; Part Number: R0402_33R_1%_0.0625W_100PPM; Component Kind: Standard; Component Type: Standard; Pin Count: 2; Value: 33; Status: Not Recommended; Power: 0.0625W; Manufacturer Part Number: R0402_33R_1%_0.0625W_100PPM; Case: 0402; Mounted: Yes; Sense: No; Socket: No; SMD: Yes; Manufacturer1 Example: YAGEO PHYCOMP; Manufacturer1 ComponentHeight: 0.4mm; HelpURL: \\cern.ch\dfs\Applications\Altium\Datasheets\R0402_Phycomp_RC0402.pdf; Author: CERN DEM JLC; CreateDate: 03.12.2007; LatestRevisionDate: 17.10.2012
SW1 = SW_TYCO_1571983-4: 4 Ways SPST DIP Switch; Part Description: 4 Way SPST SMD DIP Switch, Latched, Contact Rating 0.025A 24VDC; Manufacturer: TYCO; Manufacturer Part Number: 1571983-4 or GDH04S04; PressFit: No; Part Number: SW_TYCO_1571983-4; Component Kind: Standard; Component Type: Standard; Pin Count: 8; PackageDescription: Pitch 1.27mm,  Body 6.2x6.2mm, 4 Ways SPST Surface-Mount DIP Switch, TYCO GDH Series; Family: Switch; Mounted: Yes; Socket: No; SMD: Yes; Sense: No; Status: None; ComponentHeight: 2.31mm; HelpURL: \\cern.ch\dfs\Applications\Altium\Datasheets\SW_TYCO_1571983-4.pdf; Author: CERN DEM JLC; CreateDate: 08-Jan-09; LatestRevisionDate: 08-Jan-09
TP2-TP4 = SMD_PAD_1.27X1.27MM: Part Description: 1.27mm x 1.27mm PCB Copper Area (SMD Test Point); Mounted: No; Part Number: SMD_PAD_1.27X1.27MM; Component Kind: Standard (No BOM); Component Type: Standard (No BOM); Pin Count: 1; Family: Test Point; Socket: No; SMD: Yes; Sense: No; Status: None; ComponentHeight: 0mm; HelpURL: Undefined; Author: CERN DEM JLC; CreateDate: 12.01.2008; LatestRevisionDate: 12.01.2008; PackageDescription: 1.27mm x 1.27mm PCB Copper Area (SMD Test Point)